# EAGLE design nano_motor (EAGLE 7.2.0)
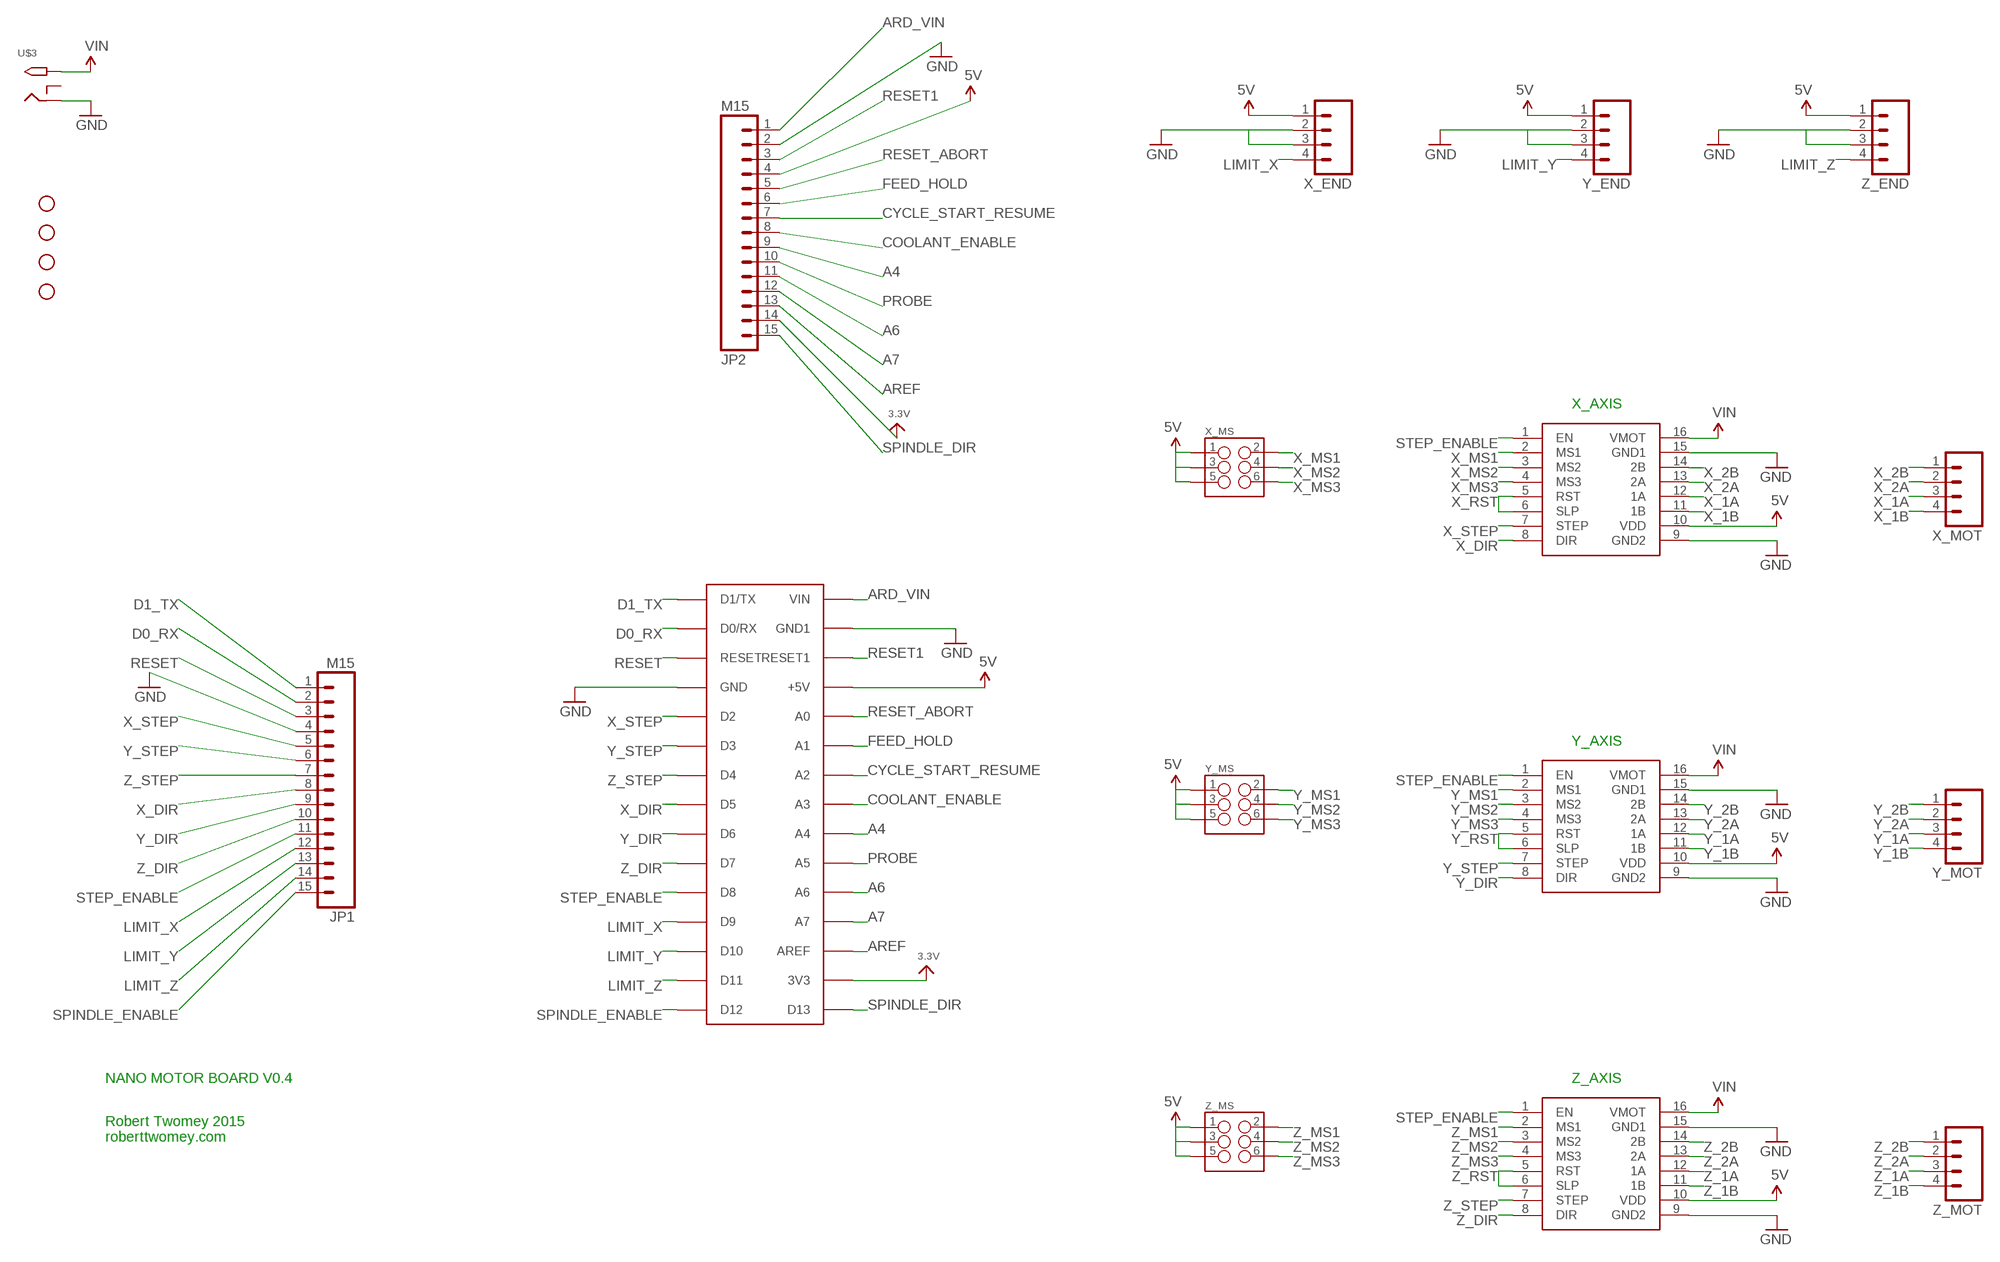
[diagram p0: schematic, sheet 1]

## Parts
JP1  M15  [1X15]
JP2  M15  [1X15]
NANO  ARDUINONANO  [PDIP-32]
STANDOFF1  STAND-OFF  [STAND-OFF]
STANDOFF2  STAND-OFF  [STAND-OFF]
STANDOFF3  STAND-OFF  [STAND-OFF]
STANDOFF4  STAND-OFF  [STAND-OFF]
U$3  2.1MMJACKTHM  [PJ-102A]
X_AXIS  POLOLUESTEPPERDRIVER  [DIL16]
X_END  M04PTH  [1X04]
X_MOT  M04PTH  [1X04]
X_MS  M03X22X3_SILK_SM  [2X3]
Y_AXIS  POLOLUESTEPPERDRIVER  [DIL16]
Y_END  M04PTH  [1X04]
Y_MOT  M04PTH  [1X04]
Y_MS  M03X22X3_SILK_SM  [2X3]
Z_AXIS  POLOLUESTEPPERDRIVER  [DIL16]
Z_END  M04PTH  [1X04]
Z_MOT  M04PTH  [1X04]
Z_MS  M03X22X3_SILK_SM  [2X3]

## Nets
3.3V: JP2.14 NANO.3V3
5V: JP2.4 NANO.+5V X_AXIS.10(VDD) X_END.1 X_MS.1 X_MS.3 X_MS.5 Y_AXIS.10(VDD) Y_END.1 Y_MS.1 Y_MS.3 Y_MS.5 Z_AXIS.10(VDD) Z_END.1 Z_MS.1 Z_MS.3 Z_MS.5
A4: JP2.9 NANO.A4
A6: JP2.11 NANO.A6
A7: JP2.12 NANO.A7
ARD_VIN: JP2.1 NANO.VIN
AREF: JP2.13 NANO.AREF
COOLANT_ENABLE: JP2.8 NANO.A3
CYCLE_START_RESUME: JP2.7 NANO.A2
D0_RX: JP1.2 NANO.D0/RX
D1_TX: JP1.1 NANO.D1/TX
FEED_HOLD: JP2.6 NANO.A1
GND: JP1.4 JP2.2 NANO.GND NANO.GND1 U$3.RING X_AXIS.9(GND2) X_AXIS.15(GND1) X_END.2 X_END.3 Y_AXIS.9(GND2) Y_AXIS.15(GND1) Y_END.2 Y_END.3 Z_AXIS.9(GND2) Z_AXIS.15(GND1) Z_END.2 Z_END.3
LIMIT_X: JP1.12 NANO.D9 X_END.4
LIMIT_Y: JP1.13 NANO.D10 Y_END.4
LIMIT_Z: JP1.14 NANO.D11 Z_END.4
PROBE: JP2.10 NANO.A5
RESET: JP1.3 NANO.RESET
RESET1: JP2.3 NANO.RESET1
RESET_ABORT: JP2.5 NANO.A0
SPINDLE_DIR: JP2.15 NANO.D13
SPINDLE_ENABLE: JP1.15 NANO.D12
STEP_ENABLE: JP1.11 NANO.D8 X_AXIS.1(EN) Y_AXIS.1(EN) Z_AXIS.1(EN)
VIN: U$3.TIP X_AXIS.16(VMOT) Y_AXIS.16(VMOT) Z_AXIS.16(VMOT)
X_1A: X_AXIS.12(1A) X_MOT.3
X_1B: X_AXIS.11(1B) X_MOT.4
X_2A: X_AXIS.13(2A) X_MOT.2
X_2B: X_AXIS.14(2B) X_MOT.1
X_DIR: JP1.8 NANO.D5 X_AXIS.8(DIR)
X_MS1: X_AXIS.2(MS1) X_MS.2
X_MS2: X_AXIS.3(MS2) X_MS.4
X_MS3: X_AXIS.4(MS3) X_MS.6
X_RST: X_AXIS.5(RST) X_AXIS.6(SLP)
X_STEP: JP1.5 NANO.D2 X_AXIS.7(STEP)
Y_1A: Y_AXIS.12(1A) Y_MOT.3
Y_1B: Y_AXIS.11(1B) Y_MOT.4
Y_2A: Y_AXIS.13(2A) Y_MOT.2
Y_2B: Y_AXIS.14(2B) Y_MOT.1
Y_DIR: JP1.9 NANO.D6 Y_AXIS.8(DIR)
Y_MS1: Y_AXIS.2(MS1) Y_MS.2
Y_MS2: Y_AXIS.3(MS2) Y_MS.4
Y_MS3: Y_AXIS.4(MS3) Y_MS.6
Y_RST: Y_AXIS.5(RST) Y_AXIS.6(SLP)
Y_STEP: JP1.6 NANO.D3 Y_AXIS.7(STEP)
Z_1A: Z_AXIS.12(1A) Z_MOT.3
Z_1B: Z_AXIS.11(1B) Z_MOT.4
Z_2A: Z_AXIS.13(2A) Z_MOT.2
Z_2B: Z_AXIS.14(2B) Z_MOT.1
Z_DIR: JP1.10 NANO.D7 Z_AXIS.8(DIR)
Z_MS1: Z_AXIS.2(MS1) Z_MS.2
Z_MS2: Z_AXIS.3(MS2) Z_MS.4
Z_MS3: Z_AXIS.4(MS3) Z_MS.6
Z_RST: Z_AXIS.5(RST) Z_AXIS.6(SLP)
Z_STEP: JP1.7 NANO.D4 Z_AXIS.7(STEP)
Unconnected: U$3.RING_SW

## Notes on the sheet
- X_AXIS
- Y_AXIS
- NANO MOTOR BOARD V0.4 | Z_AXIS
- Robert Twomey 2015 
  roberttwomey.com

## Library data of the parts
JP1 JP2 = SparkFun-Connectors:M15: Header 15 Standard 15-pin 0.1" header. Use with straight break away headers (SKU : PRT-00116), right angle break away headers (PRT-00553), swiss pins (PRT-00743), machine pins (PRT-00117), and female headers (PRT-00115).
NANO = rocketfarm:ARDUINONANO
STANDOFF1-STANDOFF4 = SparkFun-Electromechanical:STAND-OFF: #4 Stand Off This is the mechanical footprint for a #4 phillips button head screw. Use the keepout ring to avoid running the screw head into surrounding components. SKU : PRT-00447
U$3 = adafruit:2.1MMJACK: 2.1mm x 5.5mm THM DC jack with internal switch. Digikey part #PJ-102A, 4UCON part #05537 2.1mm x 5.5mm SMT DC jack with internal switch. Digikey part #PJ-002A-SMT, 4UCON part #03267 By microbuilder.eu & adafruit.com
X_AXIS Y_AXIS Z_AXIS = reprap:POLOLUESTEPPERDRIVER: Pololu stepper driver based on the A4983.
X_END X_MOT Y_END Y_MOT Z_END Z_MOT = SparkFun-Connectors:M04: Header 4 Standard 4-pin 0.1" header. Use with straight break away headers (SKU : PRT-00116), right angle break away headers (PRT-00553), swiss pins (PRT-00743), machine pins (PRT-00117), and female headers (PRT-00115). Molex polarized connector foot print use with SKU : PRT-08231 with associated crimp pins and housings. 1MM SMD Version SKU: PRT-10208
X_MS Y_MS Z_MS = SparkFun-Connectors:M03X2: 2x3 .1" header. Shrouded, with keying- CONN-10681 SMT- CONN-11415 Pogo pins- HW-11044

## Board
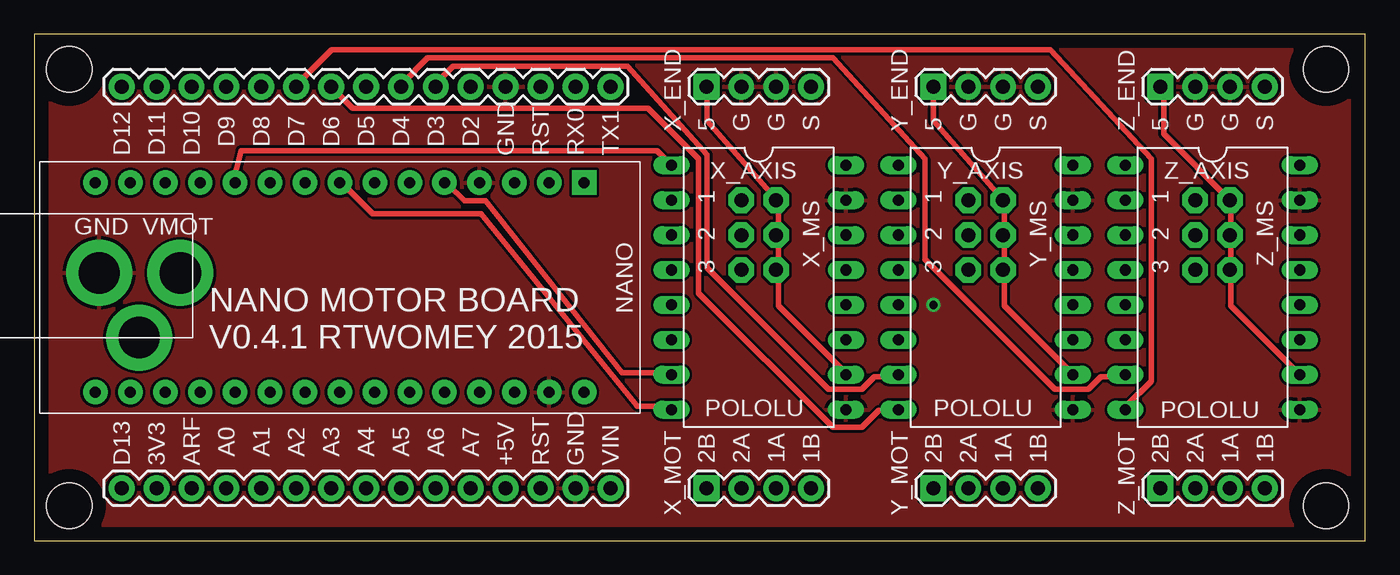
[diagram p1: board, top side]
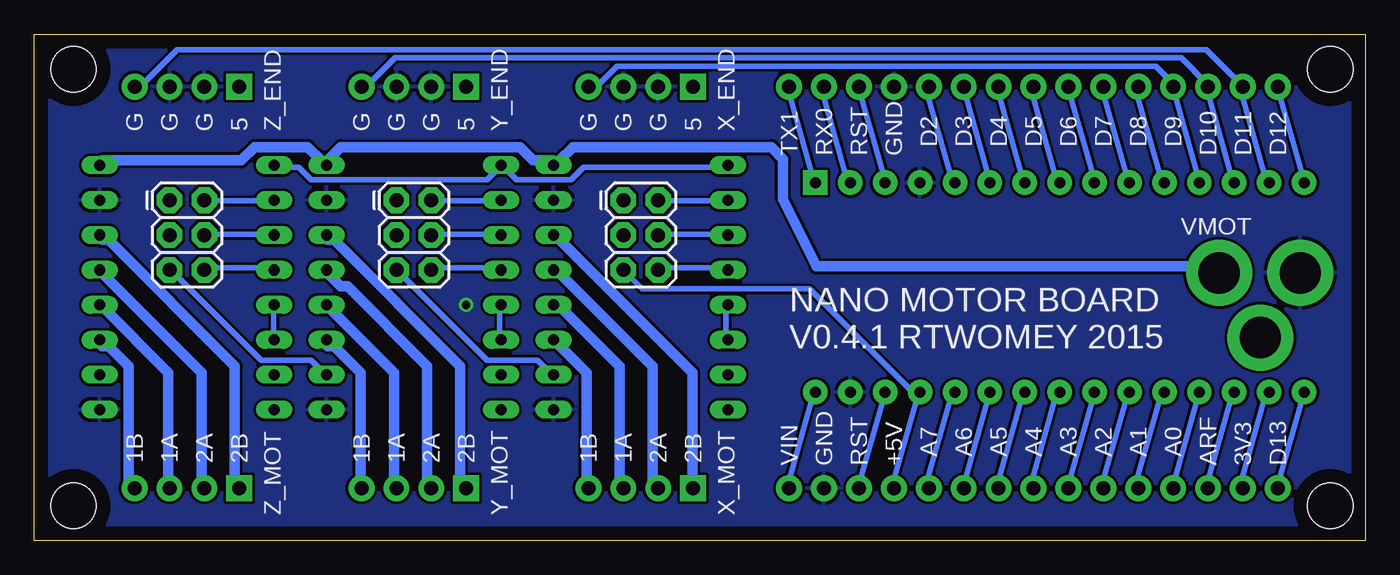
[diagram p2: board, bottom side, seen from below]

Size 96.83 x 36.82 mm. Coordinates in mm from the lower left corner, seen from the top.
Outline: 0,0 96.83,0 96.83,36.82 0,36.82 0,0
Copper layers (1*16): Top 0.035mm / dielectric 1.5mm / Bottom 0.035mm
Design rules "default *": minimum track width 16mil, minimum drill 24mil, track to track 8mil, track to pad 8mil, pad to pad 8mil, via to via 8mil, smd to smd 8mil, copper to edge 40mil, drill to drill 8mil, minimum pad ring 10mil, minimum via ring 8mil, stop-mask expansion 4mil, vias tented up to drill 0mil, thermal gap 10mil

### Footprints (pad centres in the part's own frame; a part is rotated, then mirrored left to right if it is on the bottom)
1X15 = drill 1.016 pad 1.88: 1 0,0; 2 2.54,0; 3 5.08,0; 4 7.62,0; 5 10.16,0; 6 12.7,0; 7 15.24,0; 8 17.78,0; 9 20.32,0; 10 22.86,0; 11 25.4,0; 12 27.94,0; 13 30.48,0; 14 33.02,0; 15 35.56,0
PDIP-32 = drill 0.8 pad 1.778: 3V3 15.24,-35.56; +5V 15.24,-10.16; A0 15.24,-12.7; A1 15.24,-15.24; A2 15.24,-17.78; A3 15.24,-20.32; A4 15.24,-22.86; A5 15.24,-25.4; A6 15.24,-27.94; A7 15.24,-30.48; AREF 15.24,-33.02; D0/RX 0,-5.08; D2 0,-12.7; D3 0,-15.24; D4 0,-17.78; D5 0,-20.32; D6 0,-22.86; D7 0,-25.4; D8 0,-27.94; D9 0,-30.48; D10 0,-33.02; D11 0,-35.56; D12 0,-38.1; D13 15.24,-38.1; GND 0,-10.16; GND1 15.24,-5.08; RESET 0,-7.62; RESET1 15.24,-7.62; VIN 15.24,-2.54 | drill 0.8 pad 1.778 square: D1/TX 0,-2.54
STAND-OFF = hole 3.302: 0,0
PJ-102A = drill 3 pad 4.8: RING 0.1,-3.39; RING_SW -4.6,-6.29; TIP 0.1,-9.29
DIL16 = drill 0.813 long: 1 -6.35,8.89; 2 -6.35,6.35; 3 -6.35,3.81; 4 -6.35,1.27; 5 -6.35,-1.27; 6 -6.35,-3.81; 7 -6.35,-6.35; 8 -6.35,-8.89; 9 6.35,-8.89; 10 6.35,-6.35; 11 6.35,-3.81; 12 6.35,-1.27; 13 6.35,1.27; 14 6.35,3.81; 15 6.35,6.35; 16 6.35,8.89
1X04 = drill 1.016 pad 1.88 square: 1 0,0 | drill 1.016 pad 1.88: 2 2.54,0; 3 5.08,0; 4 7.62,0
2X3 = drill 1.016 pad 1.88 octagon: 1 0,0; 2 0,2.54; 3 2.54,0; 4 2.54,2.54; 5 5.08,0; 6 5.08,2.54

### Placement (x,y rotation side)
JP1  41.91,33.02 180 top
JP2  41.91,3.81 180 top
NANO  42.55,26.04 270 top
STANDOFF1  2.54,2.54 0 top
STANDOFF2  93.98,2.54 0 top
STANDOFF3  93.98,34.29 0 top
STANDOFF4  2.54,34.29 0 top
U$3  1.33,19.37 90 top
X_AXIS  52.7,18.41 0 top
X_END  48.9,33.02 0 top
X_MOT  48.9,3.81 0 top
X_MS  53.98,24.77 270 bottom
Y_AXIS  69.22,18.41 0 top
Y_END  65.41,33.02 0 top
Y_MOT  65.41,3.81 0 top
Y_MS  70.48,24.77 270 bottom
Z_AXIS  85.72,18.41 0 top
Z_END  81.92,33.02 0 top
Z_MOT  81.92,3.81 0 top
Z_MS  87,24.77 270 bottom

### Tracks (layer width: path | path; a pad name or v marks a point on that pad's centre or on a via)
3.3V
  Bottom 0.406: NANO.3V3 7.21,10.69 9.12,3.96 JP2.14
5V
  Top 0.406: Z_MS.5 87.05,19.84 87.05,21.97 Z_MS.3 87.05,22.28 87.05,24.71 Z_MS.1 82.17,29.59 82.17,32.97 Z_END.1 | Y_MS.5 70.59,19.84 70.59,21.97 Y_MS.3 70.59,22.28 70.59,24.71 Y_MS.1 70.28,25.02 65.41,30.53 Y_END.1 | Z_AXIS.10 87.05,17.09 87.05,19.53 Z_MS.5 | Y_MS.5 70.59,19.53 70.59,17.09 75.46,12.22 Y_AXIS.10 75.77,12.22 | X_END.1 48.95,32.97 48.95,30.53 53.82,25.02 X_MS.1 54.13,24.71 54.13,22.28 X_MS.3 54.13,21.97 54.13,19.84 X_MS.5 54.13,19.53 54.13,17.09 59,12.22 X_AXIS.10 59.31,12.22 | 70.28,19.53 Y_MS.5 | 86.74,19.53 Z_MS.5
  Bottom 0.406: JP2.4 34.42,3.96 32.51,10.69 NANO.+5V 32.51,11 33.12,11 40.44,18.31 52.6,18.31 X_MS.5 | X_AXIS.10 59.31,12.22 60.22,13.13 63.88,13.13 70.28,19.53 Y_MS.5 | Y_AXIS.10 75.77,12.22 76.68,13.13 80.34,13.13 86.74,19.53 Z_MS.5
A4
  Bottom 0.406: NANO.A4 19.71,10.69 21.61,3.96 JP2.9
A6
  Bottom 0.406: NANO.A6 14.83,10.69 16.74,3.96 JP2.11
A7
  Bottom 0.406: NANO.A7 12.09,10.69 13.99,3.96 JP2.12
ARD_VIN
  Bottom 0.406: NANO.VIN 40.13,10.69 42.04,3.96 JP2.1
AREF
  Bottom 0.406: NANO.AREF 9.65,10.69 11.56,3.96 JP2.13
COOLANT_ENABLE
  Bottom 0.406: NANO.A3 22.45,10.69 24.36,3.96 JP2.8
CYCLE_START_RESUME
  Bottom 0.406: NANO.A2 24.89,10.69 26.8,3.96 JP2.7
D0_RX
  Bottom 0.406: NANO.D0/RX 37.69,26.24 39.6,32.97 JP1.2
D1_TX
  Bottom 0.406: NANO.D1/TX 40.13,26.24 42.04,32.97 JP1.1
FEED_HOLD
  Bottom 0.406: NANO.A1 27.33,10.69 29.23,3.96 JP2.6
GND  (via drill 0.6)
  other vias: 65.41,17.14
  pour Top: 0,0 0,37.47 97.16,37.47 97.16,0
  pour Bottom: 0,0 0,36.83 97.16,36.83 97.16,0
LIMIT_X
  Bottom 0.406: NANO.D9 12.09,26.24 13.99,32.97 JP1.12 13.99,33.27 15.21,34.49 54.43,34.49 55.65,33.27 56.26,33.27 X_END.4
LIMIT_Y
  Bottom 0.406: NANO.D10 9.65,26.24 11.56,32.97 JP1.13 11.56,33.27 13.39,35.1 70.59,35.1 72.42,33.27 73.03,33.27 Y_END.4
LIMIT_Z
  Bottom 0.406: NANO.D11 7.21,26.24 9.12,32.97 JP1.14 9.12,33.27 11.56,35.71 86.44,35.71 88.88,33.27 89.48,33.27 Z_END.4
PROBE
  Bottom 0.406: NANO.A5 17.27,10.69 19.18,3.96 JP2.10
RESET
  Bottom 0.406: NANO.RESET 34.95,26.24 36.85,32.97 JP1.3
RESET1
  Bottom 0.406: NANO.RESET1 34.95,10.69 36.85,3.96 JP2.3
RESET_ABORT
  Bottom 0.406: NANO.A0 30.07,10.69 31.98,3.96 JP2.5
SPINDLE_DIR
  Bottom 0.406: NANO.D13 4.47,10.69 6.38,3.96 JP2.15
SPINDLE_ENABLE
  Bottom 0.406: NANO.D12 4.47,26.24 6.38,32.97 JP1.15
STEP_ENABLE
  Top 0.406: X_AXIS.1 45.29,28.37 15.04,28.37 14.49,26.24 14.83,26.24 NANO.D8
  Bottom 0.406: JP1.11 16.74,32.97 14.83,26.24 NANO.D8 | X_AXIS.1 46.51,27.15 56.87,27.15 57.78,26.24 61.75,26.24 62.66,27.15 Y_AXIS.1 62.97,27.15 63.88,26.24 76.68,26.24 77.6,27.15 79.12,27.15 Z_AXIS.1
VIN
  Bottom 0.762: Z_AXIS.16 91.9,27.66 81.76,27.66 80.8,28.63 76.94,28.63 75.97,27.66 Y_AXIS.16 75.49,27.66 74.52,28.63 61.49,28.63 60.53,27.66 59.08,27.66 X_AXIS.16 58.6,27.66 57.63,28.63 43.18,28.63 42.34,27.72 42.34,24.83 39.93,19.94 10.64,19.94 U$3.TIP
X_1A
  Bottom 0.762: X_AXIS.12 58.6,17.04 54.25,12.7 54.25,3.86 X_MOT.3
X_1B
  Bottom 0.762: X_AXIS.11 56.67,12.22 56.67,3.86 X_MOT.4
X_2A
  Bottom 0.762: X_AXIS.13 58.6,19.46 51.84,12.7 51.84,3.86 X_MOT.2
X_2B
  Bottom 0.762: X_AXIS.14 58.6,21.87 48.95,12.22 48.95,3.86 X_MOT.1
X_DIR
  Top 0.406: X_AXIS.8 46.2,9.78 43.88,9.78 43.81,9.84 32.51,23.79 24.6,23.79 22.45,25.93 NANO.D5
  Bottom 0.406: JP1.8 24.36,32.97 22.45,26.24 NANO.D5
X_MS1
  Bottom 0.406: X_AXIS.2 46.51,24.71 51.38,24.71 X_MS.2
X_MS2
  Bottom 0.406: X_AXIS.3 46.51,22.28 51.38,22.28 X_MS.4
X_MS3
  Bottom 0.406: X_AXIS.4 46.51,19.84 51.38,19.84 X_MS.6
X_RST
  Bottom 0.406: X_AXIS.6 46.51,14.66 46.51,17.09 X_AXIS.5
X_STEP
  Top 0.406: X_AXIS.7 46.2,12.22 42.77,12.22 32.82,24.71 31.29,24.71 30.07,25.93 NANO.D2
  Bottom 0.406: JP1.5 31.98,32.97 30.07,26.24 NANO.D2
Y_1A
  Bottom 0.762: Y_AXIS.12 75.49,17.04 70.66,12.22 70.66,3.86 Y_MOT.3
Y_1B
  Bottom 0.762: Y_AXIS.11 75.49,14.15 75.01,14.15 73.08,12.22 73.08,3.86 Y_MOT.4
Y_2A
  Bottom 0.762: Y_AXIS.13 75.49,19.46 74.52,18.49 74.04,18.49 68.25,12.7 68.25,3.86 Y_MOT.2
Y_2B
  Bottom 0.406: 65.84,3.96 65.41,3.96 Y_MOT.1
  Bottom 0.762: 65.84,3.86 65.84,3.96 65.84,12.7 75.01,21.87 75.49,21.87 Y_AXIS.14
Y_DIR
  Top 0.406: Y_AXIS.8 62.66,9.47 61.44,9.47 60.22,8.26 58.09,8.26 48.34,18.01 48.34,27.76 44.65,31.45 23.14,31.45 21.61,32.97 JP1.9
  Bottom 0.406: NANO.D6 19.71,26.24 21.61,32.97 JP1.9
Y_MS1
  Bottom 0.406: Y_AXIS.2 62.97,24.71 67.84,24.71 Y_MS.2
Y_MS2
  Bottom 0.406: Y_AXIS.3 62.97,22.28 67.84,22.28 Y_MS.4
Y_MS3
  Bottom 0.406: Y_AXIS.4 62.97,19.84 67.84,19.84 Y_MS.6
Y_RST
  Bottom 0.406: Y_AXIS.6 62.97,14.66 62.97,17.09 Y_AXIS.5
Y_STEP
  Top 0.406: Y_AXIS.7 62.66,11.91 61.14,11.91 60.22,11 57.78,11 48.95,19.84 48.95,28.07 43.16,34.49 30.45,34.49 29.23,33.27 JP1.6
  Bottom 0.406: NANO.D3 27.33,26.24 29.23,32.97 JP1.6
Z_1A
  Bottom 0.762: Z_AXIS.12 91.9,17.04 87.07,12.22 87.07,3.86 Z_MOT.3
Z_1B
  Bottom 0.762: Z_AXIS.11 91.9,14.15 91.42,14.15 89.97,12.7 89.97,3.86 Z_MOT.4
Z_2A
  Bottom 0.762: Z_AXIS.13 91.9,19.46 84.66,12.22 84.66,3.86 Z_MOT.2
Z_2B
  Bottom 0.762: Z_MOT.1 82.25,3.86 82.25,12.7 91.42,21.87 91.9,21.87 Z_AXIS.14
Z_DIR
  Top 0.406: Z_AXIS.8 79.43,9.78 81.25,11.61 81.25,27.76 73.94,35.71 21.61,35.71 19.18,33.27 JP1.10 19.18,32.97
  Bottom 0.406: NANO.D7 17.27,26.24 19.18,32.97 JP1.10
Z_MS1
  Bottom 0.406: Z_AXIS.2 79.43,24.71 84.3,24.71 Z_MS.2
Z_MS2
  Bottom 0.406: Z_AXIS.3 79.43,22.28 84.3,22.28 Z_MS.4
Z_MS3
  Bottom 0.406: Z_AXIS.4 79.43,19.84 84.3,19.84 Z_MS.6
Z_RST
  Bottom 0.406: Z_AXIS.6 79.43,14.66 79.43,17.09 Z_AXIS.5
Z_STEP
  Top 0.406: Z_AXIS.7 79.12,11.91 77.6,11.91 76.68,11 74.24,11 64.8,20.45 64.8,27.76 58.09,35.1 28.63,35.1 26.8,33.27 JP1.7 26.8,32.97
  Bottom 0.406: NANO.D4 24.89,26.24 26.8,32.97 JP1.7

### Text on the board
tNames: 5 | G | G | S | 5 | G | G | S | 5 | G | G | S | D9 | D8 | D7 | D6 | D5 | D4 | D3 | D2 | D12 | D11 | D10 | GND | RST | RX0 | TX1 | 1 | 1 | 1 | GND | VMOT | 2 | 2 | 2 | 3 | 3 | 3 | NANO MOTOR BOARD / V0.4.1 RTWOMEY 2015 | POLOLU | POLOLU | POLOLU | A0 | A1 | A2 | A3 | A4 | A5 | A6 | A7 | 2B | 2A | 1A | 1B | 2B | 2A | 1A | 1B | 2B | 2A | 1A | 1B | D13 | 3V3 | ARF | +5V | RST | GND | VIN
bNames: X_END | 5 | G | G | G | Y_END | 5 | G | G | G | Z_END | 5 | G | G | G | D9 | D8 | D7 | D6 | D5 | D4 | D3 | D2 | D12 | D11 | D10 | GND | RST | RX0 | TX1 | VMOT | NANO MOTOR BOARD / V0.4.1 RTWOMEY 2015 | A0 | A1 | A2 | A3 | A4 | A5 | A6 | A7 | 2B | 2A | 1A | 1B | 2B | 2A | 1A | 1B | 2B | 2A | 1A | 1B | D13 | 3V3 | ARF | +5V | RST | GND | VIN | X_MOT | Y_MOT | Z_MOT